# Altium schematic sheet RrIrArray.SchDoc
size A; SheetNumber: 5; SheetTotal: 11
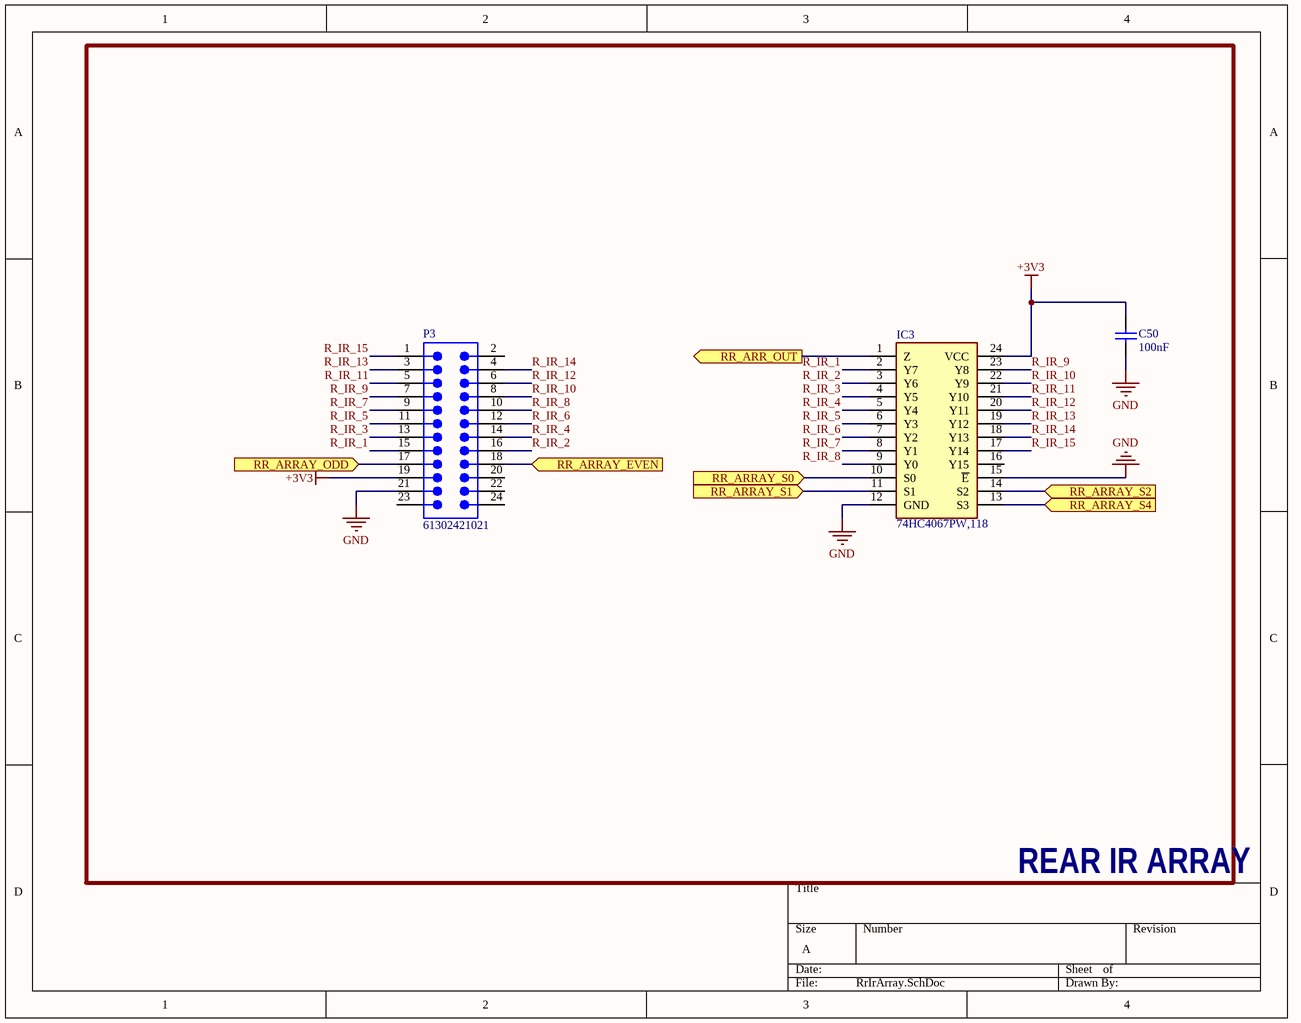
[diagram p0: RrIrArray.SchDoc]

## Parts
C50  Capacitance: 100nF  [CAPC1050X55X23ML05T13]  (hidden comment: CL05B104KO5NNNC)
IC3  74HC4067PW,118  [SOP65P640X110-24N]
P3  61302421021  [61302421021]

## Blocks framed on the sheet
REAR IR ARRAY: C50 IC3 P3

## Ports
RR_ARR_OUT (out, see Main[3C], MicroController[2B]), RR_ARRAY_EVEN (in, see Main[4C], MicroController[1C]), RR_ARRAY_ODD (in, see Main[4C], MicroController[1C]), RR_ARRAY_S0 (in, see Main[3C], MicroController[2B]), RR_ARRAY_S1 (in, see Main[3C], MicroController[2B]), RR_ARRAY_S2 (in, see Main[3C], MicroController[1D]), RR_ARRAY_S4 (in, see Main[3C], MicroController[1D])

## Nets
+3V3: C50.1 IC3.24(VCC) P3.19
GND: C50.2 IC3.12(GND) IC3.15(~{E}) P3.21
R_IR_1: IC3.2(Y7) P3.15
R_IR_2: IC3.3(Y6) P3.16
R_IR_3: IC3.4(Y5) P3.13
R_IR_4: IC3.5(Y4) P3.14
R_IR_5: IC3.6(Y3) P3.11
R_IR_6: IC3.7(Y2) P3.12
R_IR_7: IC3.8(Y1) P3.9
R_IR_8: IC3.9(Y0) P3.10
R_IR_9: IC3.23(Y8) P3.7
R_IR_10: IC3.22(Y9) P3.8
R_IR_11: IC3.21(Y10) P3.5
R_IR_12: IC3.20(Y11) P3.6
R_IR_13: IC3.19(Y12) P3.3
R_IR_14: IC3.18(Y13) P3.4
R_IR_15: IC3.17(Y14) P3.1
RR_ARR_OUT: IC3.1(Z) ; port RR_ARR_OUT
RR_ARRAY_EVEN: P3.18 ; port RR_ARRAY_EVEN
RR_ARRAY_ODD: P3.17 ; port RR_ARRAY_ODD
RR_ARRAY_S0: IC3.10(S0) ; port RR_ARRAY_S0
RR_ARRAY_S1: IC3.11(S1) ; port RR_ARRAY_S1
RR_ARRAY_S2: IC3.14(S2) ; port RR_ARRAY_S2
RR_ARRAY_S4: IC3.13(S3) ; port RR_ARRAY_S4

Not connected (* = marked no-connect by the designer): IC3 16(Y15); P3 2 20 22 23 24

## Library data of the parts
C50 = CMP-2000-05439-1: Chip Capacitor, 100 nF, +/- 10%, 16 V, -55 to 125 degC, 0402 (1005 Metric), RoHS, Tape and Reel; Manufacturer: Samsung Electro-Mechanics; Dielectric: X7R; Rated Voltage: 16V; Case Size/Dimension: 0402; Tolerance (%): ±10%; Manufacturer URL: http://www.samsungsem.com/global/index.jsp; Datasheet URL: https://datasheet.ciiva.com/29198/458718-da-01-en-vs-kondensator-0402-29198423.pdf; Datasheet Version: Nov-10
IC3 = 74HC4067PW,118: Integrated Circuit; Manufacturer_Name: Nexperia; Datasheet Link: https://assets.nexperia.com/documents/data-sheet/74HC_HCT4067.pdf; Height: 1.1mm; Manufacturer_Part_Number: 74HC4067PW,118; Mouser Part Number: 771-74HC4067PW-T; Mouser Price/Stock: https://www.mouser.co.uk/ProductDetail/Nexperia/74HC4067PW118?qs=P62ublwmbi9BArRi%252BuDUjA%3D%3D; Arrow Part Number: 74HC4067PW,118; Arrow Price/Stock: https://www.arrow.com/en/products/74hc4067pw118/nexperia?region=nac
P3 = CMP-1502-01110-2: NexarPartId: 32855562; Contact Resistance: 20mΩ; Gender: Male; Pitch: 2.54mm; Number of Contacts: 24; Current Rating: 3A; Operating Supply Voltage: 250V; Connector Type: Male Pin; REACH SVHC: Unknown; Lead Pitch: 2.54mm; Packaging: Bulk; Termination: Solder; Number of Positions: 24; Contact Mating Length: 5.9944mm; Color: Black; Contact Material: Copper; Mount: Through Hole; Contact Plating: Gold; Row Spacing: 2.54mm; Number of Pins: 24; RoHS: Compliant; Number of Rows: 2